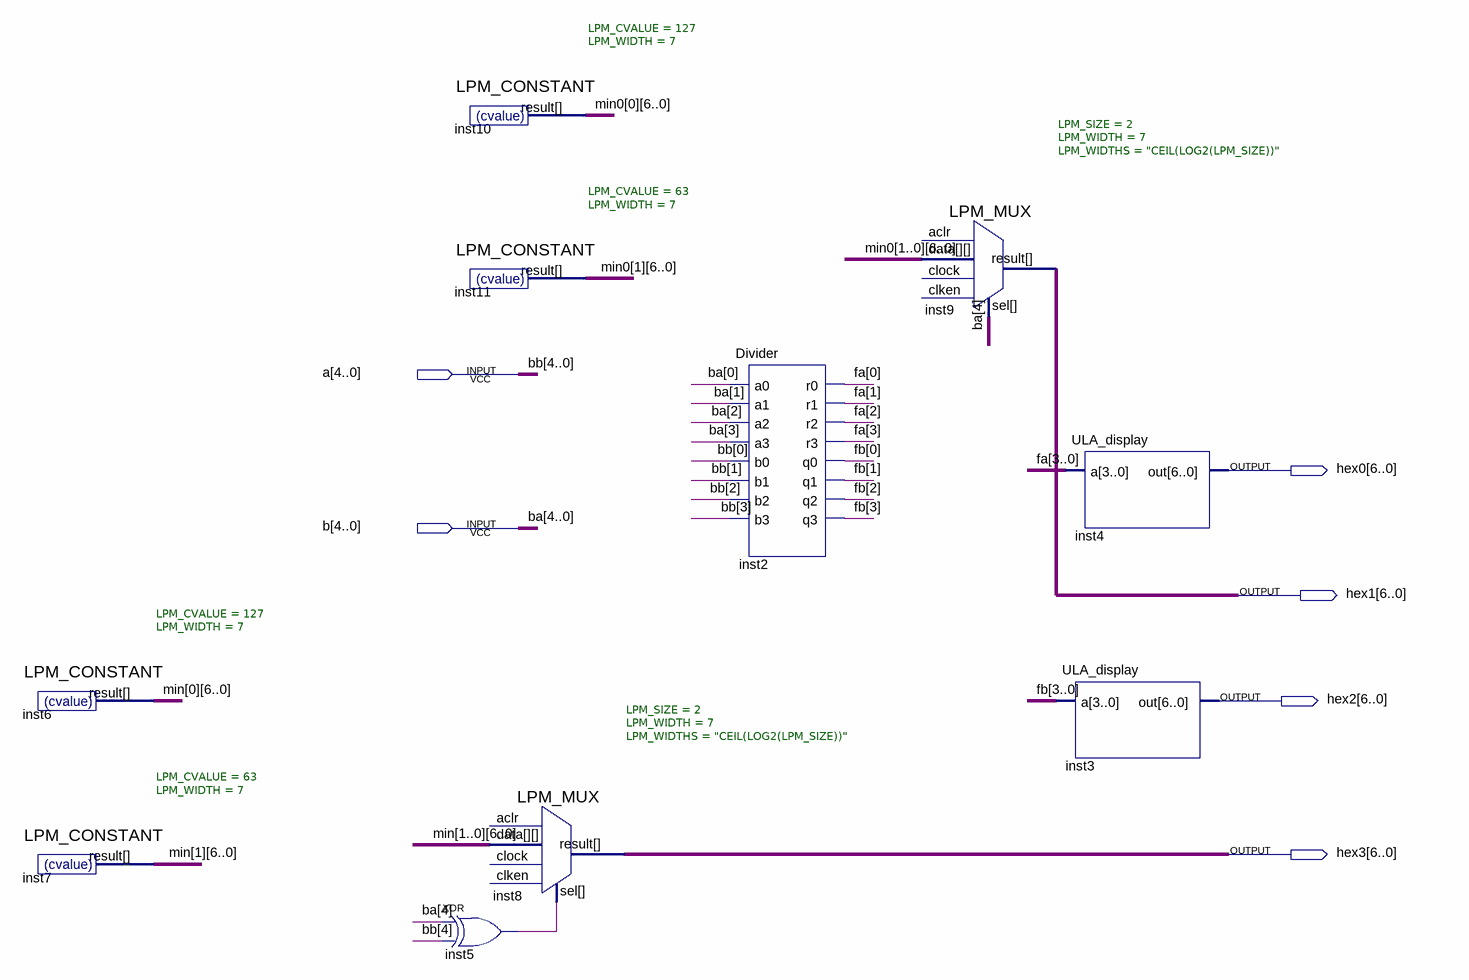
[diagram p0: schematic sheet]
// Quartus schematic ULA_div.bdf as structural Verilog: 10 symbols, 6 pins
module ULA_div (
  input  [4:0] a,
  input  [4:0] b,
  output [6:0] hex0,
  output [6:0] hex1,
  output [6:0] hex2,
  output [6:0] hex3
);

  wire inst5_out;
  wire [3:0] fa, fb;
  wire [6:0] min0_0, min0_1, min_0, min_1;

  LPM_CONSTANT #(.LPM_CVALUE(127), .LPM_WIDTH(7)) inst6 (.result(min_0));
  LPM_CONSTANT #(.LPM_CVALUE(63), .LPM_WIDTH(7)) inst7 (.result(min_1));
  LPM_CONSTANT #(.LPM_CVALUE(127), .LPM_WIDTH(7)) inst10 (.result(min0_0));
  LPM_CONSTANT #(.LPM_CVALUE(63), .LPM_WIDTH(7)) inst11 (.result(min0_1));
  xor inst5 (inst5_out, b[4], a[4]);
  LPM_MUX #(.LPM_SIZE(2), .LPM_WIDTH(7), .LPM_WIDTHS("CEIL(LOG2(LPM_SIZE))")) inst8 (
    .data({min_1, min_0}), .sel(inst5_out), .result(hex3));  // open: clock, aclr, clken
  Divider inst2 (
    .a0(b[0]), .a1(b[1]), .a2(b[2]), .a3(b[3]), .b0(a[0]), .b1(a[1]), .b2(a[2]), .b3(a[3]), .r0(fa[0]),
    .r1(fa[1]), .r2(fa[2]), .r3(fa[3]), .q0(fb[0]), .q1(fb[1]), .q2(fb[2]), .q3(fb[3]));
  LPM_MUX #(.LPM_SIZE(2), .LPM_WIDTH(7), .LPM_WIDTHS("CEIL(LOG2(LPM_SIZE))")) inst9 (
    .data({min0_1, min0_0}), .sel(b[4]), .result(hex1));  // open: clock, aclr, clken
  ULA_display inst4 (.a(fa), .out(hex0));
  ULA_display inst3 (.a(fb), .out(hex2));

  // Other names for the same wires on the sheet: ba[4:0] = b; bb[4:0] = a
endmodule
